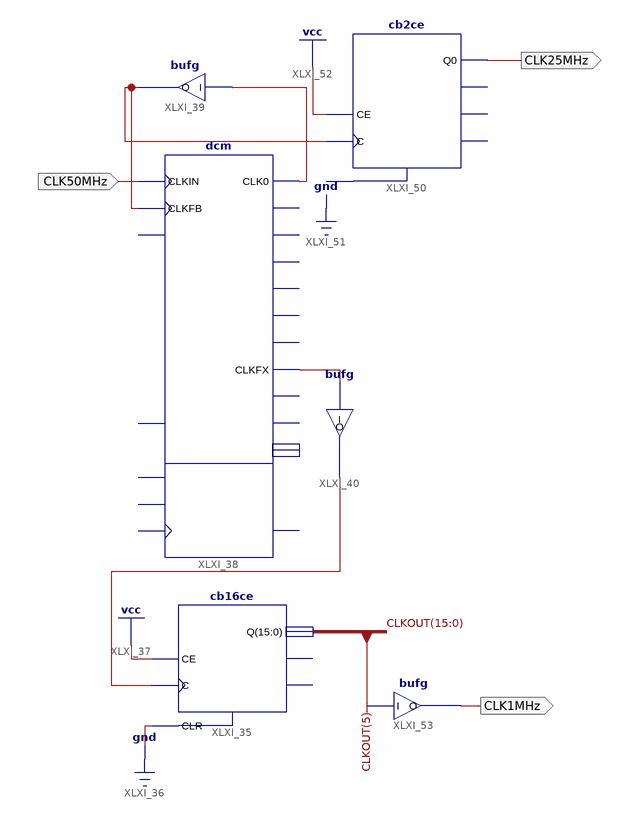
[diagram p0: schematic sheet 1]
// Xilinx ISE schematic CLK25_1MHz.sch (spartan3) as structural Verilog: 6 symbols, 3 ports
module CLK25_1MHz (
  input  CLK50MHz,
  output CLK25MHz,
  output CLK1MHz
);

  wire CLK66MHz, XLXN_72, XLXN_73, XLXN_109;
  wire [15:0] CLKOUT;

  cb2ce XLXI_50 (.C(XLXN_109), .CE(1'b1), .Q0(CLK25MHz));  // open: CLR, CEO, Q1, TC
  bufg XLXI_39 (.I(XLXN_73), .O(XLXN_109));
  bufg XLXI_40 (.I(XLXN_72), .O(CLK66MHz));
  cb16ce XLXI_35 (.C(CLK66MHz), .CE(1'b1), .CLR(1'b0), .Q(CLKOUT));  // open: CEO, TC
  bufg XLXI_53 (.I(CLKOUT[5]), .O(CLK1MHz));
  dcm #(.CLKFX_MULTIPLY(4), .CLKFX_DIVIDE(3)) XLXI_38 (
    .CLKFB(XLXN_109), .CLKIN(CLK50MHz), .CLK0(XLXN_73), .CLKFX(XLXN_72));  // open: DSSEN, PSCLK, PSEN, PSINCDEC, RST, CLK180, CLK270, CLK2X, CLK2X180, CLK90, CLKDV, CLKFX180, LOCKED, PSDONE, STATUS
endmodule
